# Altium schematic sheet UI-LEDs.SchDoc
size A; SheetNumber: 13; SheetTotal: 15
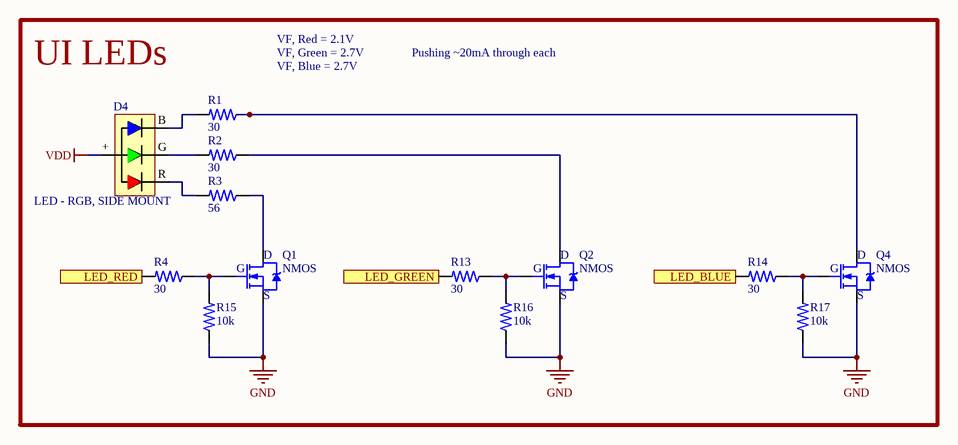
[diagram p0: UI-LEDs.SchDoc]

## Parts
D4  LED - RGB, SIDE MOUNT  [FM-3510RGBA-SG]
Q1  NMOS  [SOT-23]
Q2  NMOS  [SOT-23]
Q4  NMOS  [SOT-23]
R1  value 30  [0402R]  (hidden comment: RES)
R2  value 30  [0402R]  (hidden comment: RES)
R3  value 56  [0402R]  (hidden comment: RES)
R4  value 30  [0402R]  (hidden comment: RES)
R13  value 30  [0402R]  (hidden comment: RES)
R14  value 30  [0402R]  (hidden comment: RES)
R15  value 10k  [0402R]  (hidden comment: RES)
R16  value 10k  [0402R]  (hidden comment: RES)
R17  value 10k  [0402R]  (hidden comment: RES)

## Ports
LED_BLUE (in, see PressurePulse_Pulse-PCB_Master[5C], MCU-BLE[4C]), LED_GREEN (in, see PressurePulse_Pulse-PCB_Master[5C], MCU-BLE[4C]), LED_RED (in, see PressurePulse_Pulse-PCB_Master[5C], MCU-BLE[4C])

## Nets
GND: Q1.S Q2.S Q4.S R15.1 R16.1 R17.1
VDD: D4.+
LED_BLUE: R14.2 ; port LED_BLUE
LED_GREEN: R13.2 ; port LED_GREEN
LED_RED: R4.2 ; port LED_RED
NetD4_B: D4.B R1.2
NetD4_G: D4.G R2.2
NetD4_R: D4.R R3.2
NetQ1_D: Q1.D R3.1
NetQ1_G: Q1.G R4.1 R15.2
NetQ2_D: Q2.D R2.1
NetQ2_G: Q2.G R13.1 R16.2
NetQ4_D: Q4.D R1.1
NetQ4_G: Q4.G R14.1 R17.2

## Notes on the sheet
- UI LEDs
- VF, Red = 2.1V
- VF, Green = 2.7V
- VF, Blue = 2.7V
- Pushing ~20mA through each

## Library data of the parts
D4 = LED - RGB, SIDE MOUNT: MFR: Foshan NationStar Optoelectronics; Value: FM-3510RGBA-SG; MFR PN: FM-3510RGBA-SG; JLCPCB PN: C727903
Q1 Q2 Q4 = NMOS: 100V 1.6A 1.3W 220mΩ@10V,1.6A N Channel SOT-23  MOSFETs ROHS; MFR: Infineon; Value: IRLML0100TRPBF; MFR PN: IRLML0100TRPBF; JLCPCB PN: C53658
R1-R4 R13-R17 = RES: Resistor; MFR PN: *; MFR: *
  R1 R2 R4 R13-R17: JLCPCB PN: *
  R3: JLCPCB PN: C103102